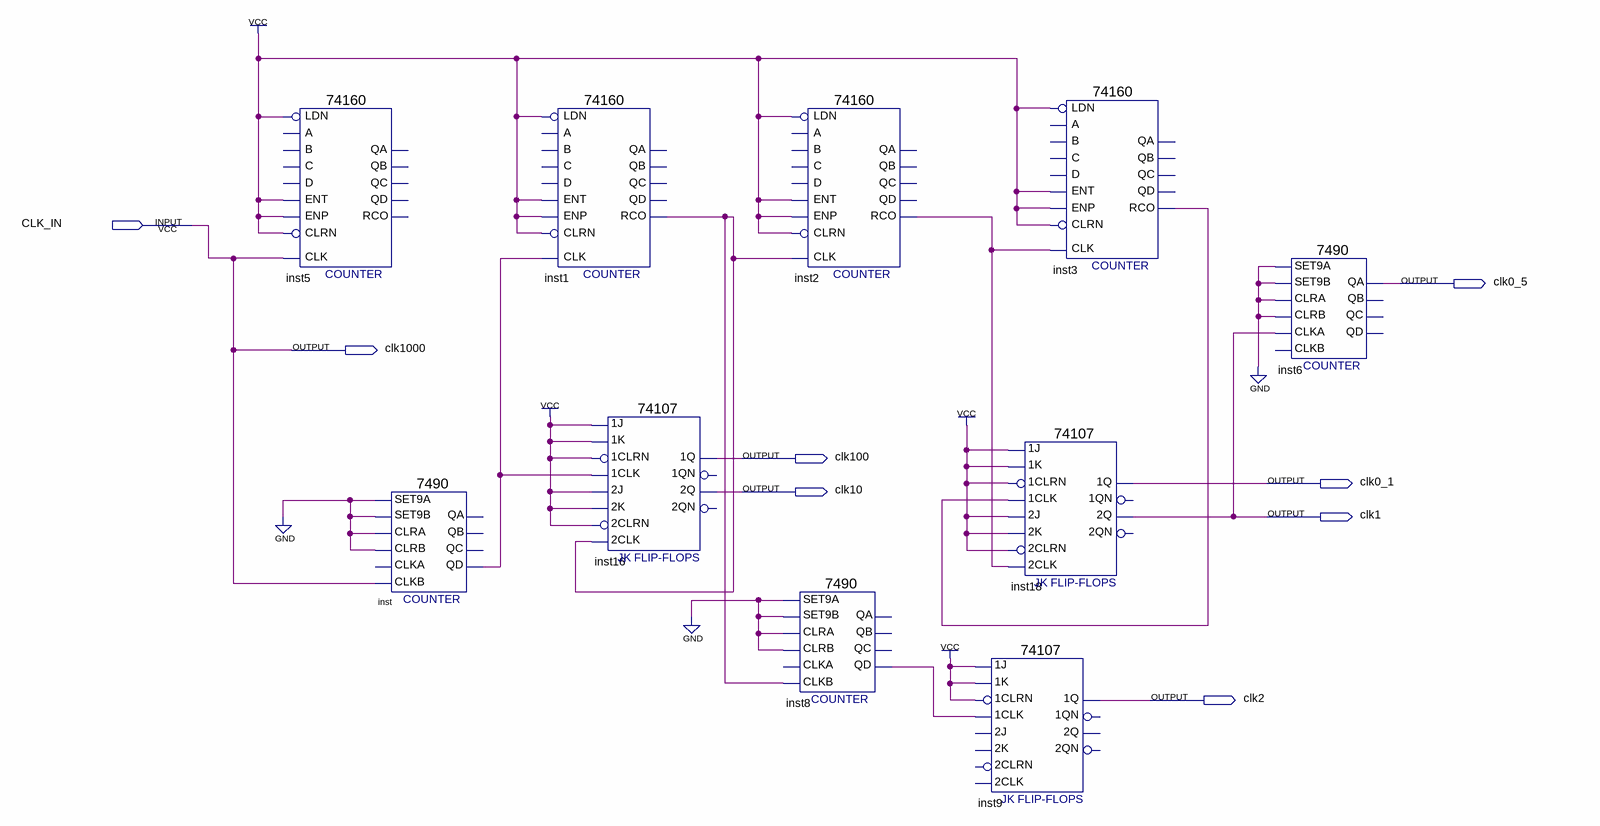
[diagram p0: schematic sheet]
// Quartus schematic fdiv.bdf as structural Verilog: 10 symbols, 8 pins
module fdiv (
  input  CLK_IN,
  output clk0_5,
  output clk1000,
  output clk100,
  output clk0_1,
  output clk10,
  output clk1,
  output clk2
);

  wire inst1_rco, inst2_rco, inst3_rco, inst8_qd, inst_qd;

  \74160  inst5 (
    .CLK(CLK_IN), .ENT(1'b1), .LDN(1'b1), .ENP(1'b1), .CLRN(1'b1));  // open: A, B, C, D, QD, QA, QB, QC, RCO
  \7490  inst (
    .SET9A(1'b0), .CLRA(1'b0), .SET9B(1'b0), .CLKB(CLK_IN), .CLRB(1'b0), .QD(inst_qd));  // open: CLKA, QA, QB, QC
  \74160  inst1 (
    .CLK(inst_qd), .ENT(1'b1), .LDN(1'b1), .ENP(1'b1), .CLRN(1'b1), .RCO(inst1_rco));  // open: A, B, C, D, QD, QA, QB, QC
  \74107  inst16 (
    .\1CLRN (1'b1), .\1K (1'b1), .\1J (1'b1), .\2K (1'b1), .\2J (1'b1), .\1CLK (inst_qd), .\2CLK (inst1_rco),
    .\2CLRN (1'b1), .\1Q (clk100), .\2Q (clk10));  // open: 1QN, 2QN
  \74160  inst2 (
    .CLK(inst1_rco), .ENT(1'b1), .LDN(1'b1), .ENP(1'b1), .CLRN(1'b1), .RCO(inst2_rco));  // open: A, B, C, D, QD, QA, QB, QC
  \7490  inst8 (
    .SET9A(1'b0), .CLRA(1'b0), .SET9B(1'b0), .CLKB(inst1_rco), .CLRB(1'b0), .QD(inst8_qd));  // open: CLKA, QA, QB, QC
  \74107  inst18 (
    .\1CLRN (1'b1), .\1K (1'b1), .\1J (1'b1), .\2K (1'b1), .\2J (1'b1), .\1CLK (inst3_rco),
    .\2CLK (inst2_rco), .\2CLRN (1'b1), .\1Q (clk0_1), .\2Q (clk1));  // open: 1QN, 2QN
  \74107  inst9 (
    .\1CLRN (1'b1), .\1K (1'b1), .\1J (1'b1), .\1CLK (inst8_qd), .\1Q (clk2));  // open: 2K, 2J, 2CLK, 2CLRN, 2Q, 1QN, 2QN
  \74160  inst3 (
    .CLK(inst2_rco), .ENT(1'b1), .LDN(1'b1), .ENP(1'b1), .CLRN(1'b1), .RCO(inst3_rco));  // open: A, B, C, D, QD, QA, QB, QC
  \7490  inst6 (
    .SET9A(1'b0), .CLRA(1'b0), .SET9B(1'b0), .CLKA(clk1), .CLRB(1'b0), .QA(clk0_5));  // open: CLKB, QD, QB, QC

  assign clk1000 = CLK_IN;
endmodule
